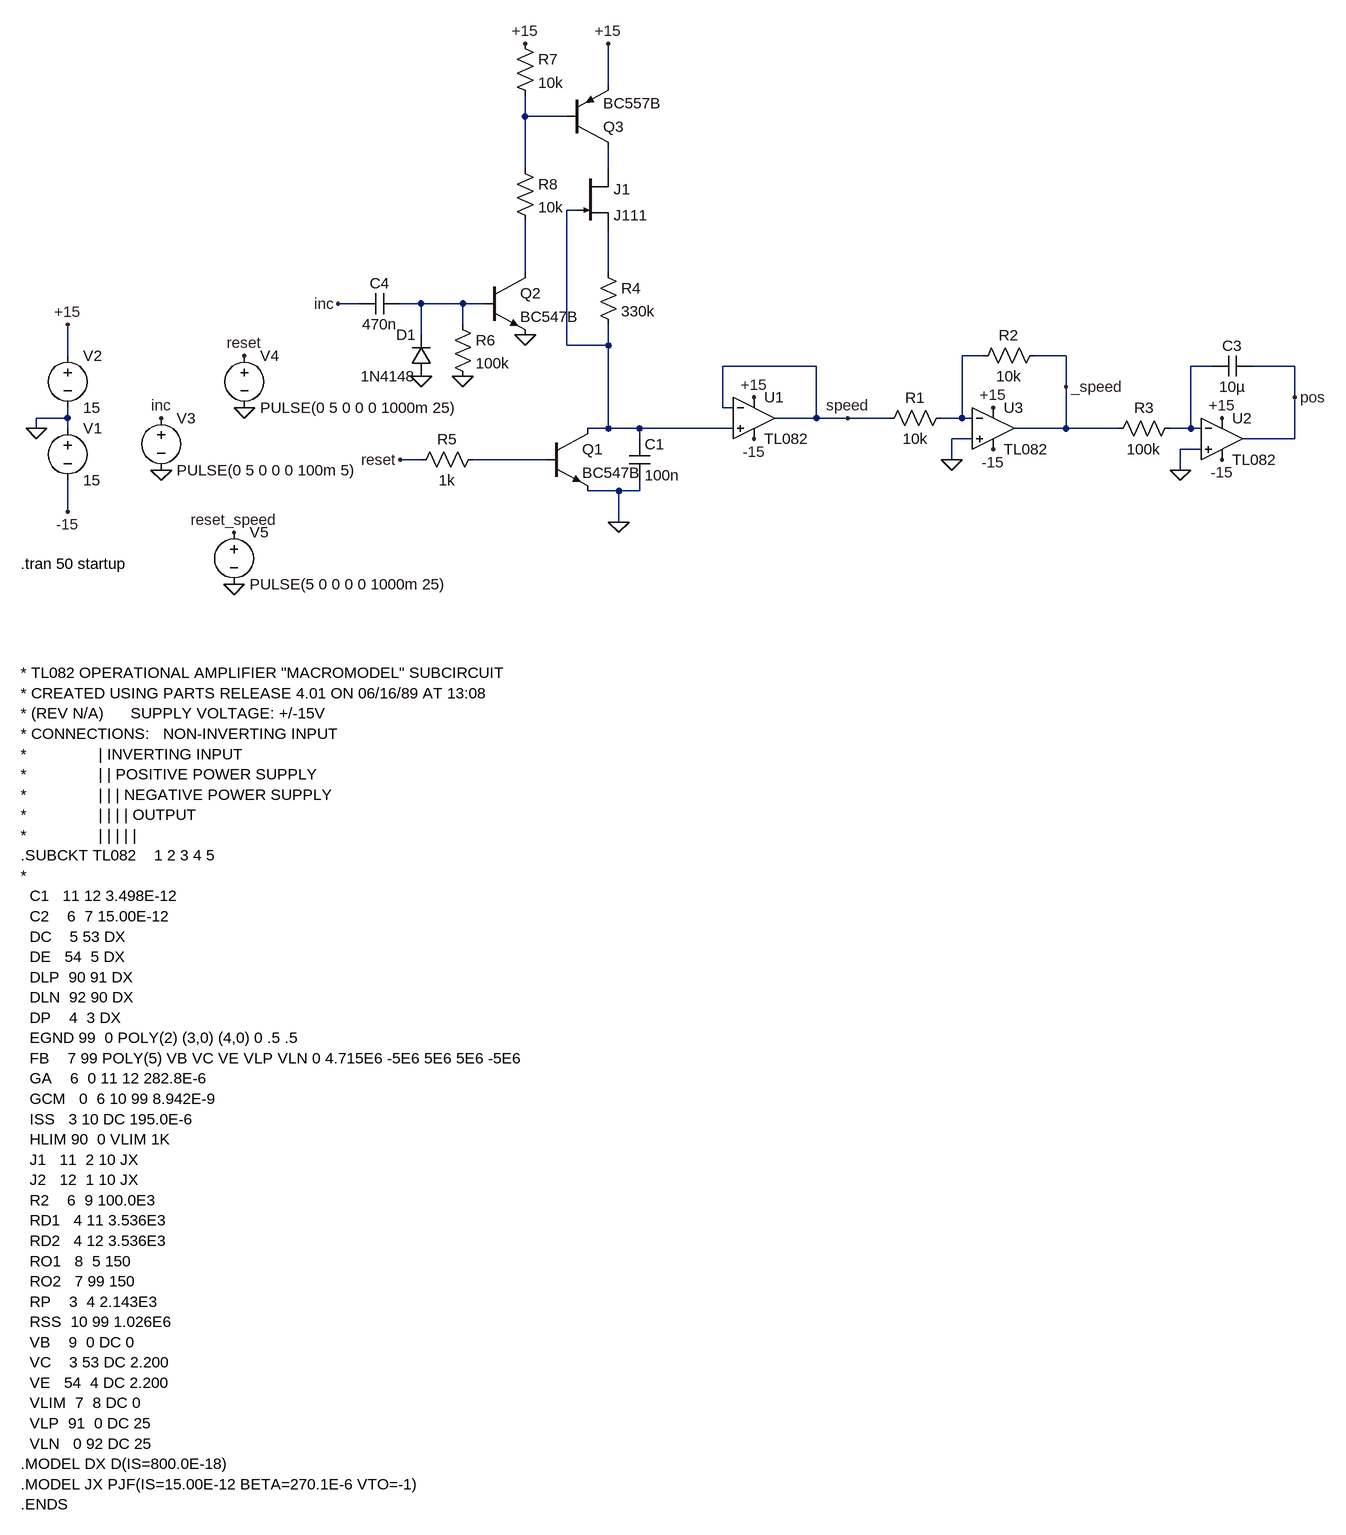
[diagram p0: schematic ball_speed.asc]
ball_speed.asc, the LTspice schematic file:
Version 4
SHEET 1 1728 1700
WIRE 656 -368 656 -432
WIRE 528 -320 528 -352
WIRE 592 -320 528 -320
WIRE 528 -240 528 -320
WIRE 656 -240 656 -272
WIRE 608 -176 592 -176
WIRE 528 -80 528 -160
WIRE 656 -80 656 -144
WIRE 272 -32 240 -32
WIRE 368 -32 336 -32
WIRE 432 -32 368 -32
WIRE 464 -32 432 -32
WIRE 432 0 432 -32
WIRE 368 16 368 -32
WIRE 592 32 592 -176
WIRE 656 32 656 0
WIRE 656 32 592 32
WIRE -176 48 -176 0
WIRE 1232 48 1200 48
WIRE 1360 48 1312 48
WIRE 976 64 832 64
WIRE 1584 64 1552 64
WIRE 1712 64 1648 64
WIRE 1360 96 1360 48
WIRE 1712 112 1712 64
WIRE 832 128 832 64
WIRE 848 128 832 128
WIRE -176 144 -176 128
WIRE -176 144 -224 144
WIRE 976 144 976 64
WIRE 976 144 912 144
WIRE 1024 144 976 144
WIRE 1088 144 1024 144
WIRE 1200 144 1200 48
WIRE 1200 144 1168 144
WIRE 1216 144 1200 144
WIRE -224 160 -224 144
WIRE -176 160 -176 144
WIRE 656 160 656 32
WIRE 656 160 624 160
WIRE 704 160 656 160
WIRE 848 160 704 160
WIRE 1360 160 1360 96
WIRE 1360 160 1280 160
WIRE 1440 160 1360 160
WIRE 1552 160 1552 64
WIRE 1552 160 1520 160
WIRE 1568 160 1552 160
WIRE 704 176 704 160
WIRE 1216 176 1184 176
WIRE 1712 176 1712 112
WIRE 1712 176 1632 176
WIRE 1568 192 1536 192
WIRE 368 208 336 208
WIRE 560 208 448 208
WIRE 1184 208 1184 176
WIRE 1536 224 1536 192
WIRE 672 256 624 256
WIRE 704 256 704 240
WIRE 704 256 672 256
WIRE -176 288 -176 240
WIRE 672 304 672 256
FLAG -224 160 0
FLAG -176 0 +15
FLAG -176 288 -15
FLAG 1248 128 +15
FLAG 1248 192 -15
FLAG 880 112 +15
FLAG 880 176 -15
FLAG 1024 144 speed
FLAG 656 -432 +15
FLAG 672 304 0
FLAG 336 208 reset
FLAG 1184 208 0
FLAG 1360 96 _speed
FLAG 1600 144 +15
FLAG 1600 208 -15
FLAG 1536 224 0
FLAG 1712 112 pos
FLAG 432 80 0
FLAG 368 80 0
FLAG 240 -32 inc
FLAG 528 16 0
FLAG 528 -432 +15
FLAG -32 224 0
FLAG -32 144 inc
FLAG 96 128 0
FLAG 96 48 reset
FLAG 80 400 0
FLAG 80 320 reset_speed
SYMBOL voltage -176 144 R0
SYMATTR InstName V1
SYMATTR Value 15
SYMBOL voltage -176 32 R0
SYMATTR InstName V2
SYMATTR Value 15
SYMBOL Opamps\\opamp2 1248 96 R0
SYMATTR InstName U3
SYMATTR Value TL082
SYMBOL Opamps\\opamp2 880 80 R0
SYMATTR InstName U1
SYMATTR Value TL082
SYMBOL cap 688 176 R0
SYMATTR InstName C1
SYMATTR Value 100n
SYMBOL res 640 -96 R0
SYMATTR InstName R4
SYMATTR Value 330k
SYMBOL njf 608 -240 R0
SYMATTR InstName J1
SYMATTR Value J111
SYMBOL npn 560 160 R0
SYMATTR InstName Q1
SYMATTR Value BC547B
SYMBOL res 1184 128 R90
WINDOW 0 0 56 VBottom 2
WINDOW 3 32 56 VTop 2
SYMATTR InstName R1
SYMATTR Value 10k
SYMBOL res 1328 32 R90
WINDOW 0 0 56 VBottom 2
WINDOW 3 32 56 VTop 2
SYMATTR InstName R2
SYMATTR Value 10k
SYMBOL Opamps\\opamp2 1600 112 R0
SYMATTR InstName U2
SYMATTR Value TL082
SYMBOL res 1536 144 R90
WINDOW 0 0 56 VBottom 2
WINDOW 3 32 56 VTop 2
SYMATTR InstName R3
SYMATTR Value 100k
SYMBOL cap 1648 48 R90
WINDOW 0 0 32 VBottom 2
WINDOW 3 32 32 VTop 2
SYMATTR InstName C3
SYMATTR Value 10µ
SYMBOL npn 464 -80 R0
SYMATTR InstName Q2
SYMATTR Value BC547B
SYMBOL diode 384 80 R180
WINDOW 0 24 64 Left 2
WINDOW 3 24 0 Left 2
SYMATTR InstName D1
SYMATTR Value 1N4148
SYMBOL res 416 -16 R0
SYMATTR InstName R6
SYMATTR Value 100k
SYMBOL cap 336 -48 R90
WINDOW 0 0 32 VBottom 2
WINDOW 3 32 32 VTop 2
SYMATTR InstName C4
SYMATTR Value 470n
SYMBOL res 464 192 R90
WINDOW 0 0 56 VBottom 2
WINDOW 3 32 56 VTop 2
SYMATTR InstName R5
SYMATTR Value 1k
SYMBOL res 512 -448 R0
SYMATTR InstName R7
SYMATTR Value 10k
SYMBOL res 512 -256 R0
SYMATTR InstName R8
SYMATTR Value 10k
SYMBOL pnp 592 -272 M180
SYMATTR InstName Q3
SYMATTR Value BC557B
SYMBOL voltage -32 128 R0
WINDOW 123 0 0 Left 0
WINDOW 39 0 0 Left 0
SYMATTR InstName V3
SYMATTR Value PULSE(0 5 0 0 0 100m 5)
SYMBOL voltage 96 32 R0
WINDOW 123 0 0 Left 0
WINDOW 39 0 0 Left 0
SYMATTR InstName V4
SYMATTR Value PULSE(0 5 0 0 0 1000m 25)
SYMBOL voltage 80 304 R0
WINDOW 123 0 0 Left 0
WINDOW 39 0 0 Left 0
SYMATTR InstName V5
SYMATTR Value PULSE(5 0 0 0 0 1000m 25)
TEXT -248 368 Left 2 !.tran 50 startup
TEXT -248 536 Left 2 !* TL082 OPERATIONAL AMPLIFIER "MACROMODEL" SUBCIRCUIT\n* CREATED USING PARTS RELEASE 4.01 ON 06/16/89 AT 13:08\n* (REV N/A)      SUPPLY VOLTAGE: +/-15V\n* CONNECTIONS:   NON-INVERTING INPUT\n*                | INVERTING INPUT\n*                | | POSITIVE POWER SUPPLY\n*                | | | NEGATIVE POWER SUPPLY\n*                | | | | OUTPUT\n*                | | | | |\n.SUBCKT TL082    1 2 3 4 5\n*\n  C1   11 12 3.498E-12\n  C2    6  7 15.00E-12\n  DC    5 53 DX\n  DE   54  5 DX\n  DLP  90 91 DX\n  DLN  92 90 DX\n  DP    4  3 DX\n  EGND 99  0 POLY(2) (3,0) (4,0) 0 .5 .5\n  FB    7 99 POLY(5) VB VC VE VLP VLN 0 4.715E6 -5E6 5E6 5E6 -5E6\n  GA    6  0 11 12 282.8E-6\n  GCM   0  6 10 99 8.942E-9\n  ISS   3 10 DC 195.0E-6\n  HLIM 90  0 VLIM 1K\n  J1   11  2 10 JX\n  J2   12  1 10 JX\n  R2    6  9 100.0E3\n  RD1   4 11 3.536E3\n  RD2   4 12 3.536E3\n  RO1   8  5 150\n  RO2   7 99 150\n  RP    3  4 2.143E3\n  RSS  10 99 1.026E6\n  VB    9  0 DC 0\n  VC    3 53 DC 2.200\n  VE   54  4 DC 2.200\n  VLIM  7  8 DC 0\n  VLP  91  0 DC 25\n  VLN   0 92 DC 25\n.MODEL DX D(IS=800.0E-18)\n.MODEL JX PJF(IS=15.00E-12 BETA=270.1E-6 VTO=-1)\n.ENDS

The netlist it stands for:
* ball_speed.asc
V1 0 -15 15
V2 +15 0 15
XU3 0 N007 +15 -15 _speed TL082  ; pins In+ In- V+ V- OUT
XU1 N003 speed +15 -15 speed TL082  ; pins In+ In- V+ V- OUT
C1 N003 0 100n
R4 N005 N003 330k
J1 N002 N003 N005 J111
Q1 N003 N009 0 0 BC547B
R1 N007 speed 10k
R2 _speed N007 10k
XU2 0 N008 +15 -15 pos TL082  ; pins In+ In- V+ V- OUT
R3 N008 _speed 100k
C3 pos N008 10µ
Q2 N004 N006 0 0 BC547B
D1 0 N006 1N4148
R6 N006 0 100k
C4 N006 inc 470n
R5 N009 reset 1k
R7 +15 N001 10k
R8 N001 N004 10k
Q3 N002 N001 +15 0 BC557B
V3 inc 0 PULSE(0 5 0 0 0 100m 5)
V4 reset 0 PULSE(0 5 0 0 0 1000m 25)
V5 reset_speed 0 PULSE(5 0 0 0 0 1000m 25)
.model D D
.lib standard.dio
.model NPN NPN
.model PNP PNP
.lib standard.bjt
.model NJF NJF
.model PJF PJF
.lib standard.jft
.tran 50 startup
* TL082 OPERATIONAL AMPLIFIER "MACROMODEL" SUBCIRCUIT
* CREATED USING PARTS RELEASE 4.01 ON 06/16/89 AT 13:08
* (REV N/A)      SUPPLY VOLTAGE: +/-15V
* CONNECTIONS:   NON-INVERTING INPUT
*                | INVERTING INPUT
*                | | POSITIVE POWER SUPPLY
*                | | | NEGATIVE POWER SUPPLY
*                | | | | OUTPUT
*                | | | | |
.SUBCKT TL082    1 2 3 4 5
*
  C1   11 12 3.498E-12
  C2    6  7 15.00E-12
  DC    5 53 DX
  DE   54  5 DX
  DLP  90 91 DX
  DLN  92 90 DX
  DP    4  3 DX
  EGND 99  0 POLY(2) (3,0) (4,0) 0 .5 .5
  FB    7 99 POLY(5) VB VC VE VLP VLN 0 4.715E6 -5E6 5E6 5E6 -5E6
  GA    6  0 11 12 282.8E-6
  GCM   0  6 10 99 8.942E-9
  ISS   3 10 DC 195.0E-6
  HLIM 90  0 VLIM 1K
  J1   11  2 10 JX
  J2   12  1 10 JX
  R2    6  9 100.0E3
  RD1   4 11 3.536E3
  RD2   4 12 3.536E3
  RO1   8  5 150
  RO2   7 99 150
  RP    3  4 2.143E3
  RSS  10 99 1.026E6
  VB    9  0 DC 0
  VC    3 53 DC 2.200
  VE   54  4 DC 2.200
  VLIM  7  8 DC 0
  VLP  91  0 DC 25
  VLN   0 92 DC 25
.MODEL DX D(IS=800.0E-18)
.MODEL JX PJF(IS=15.00E-12 BETA=270.1E-6 VTO=-1)
.ENDS
.backanno
.end